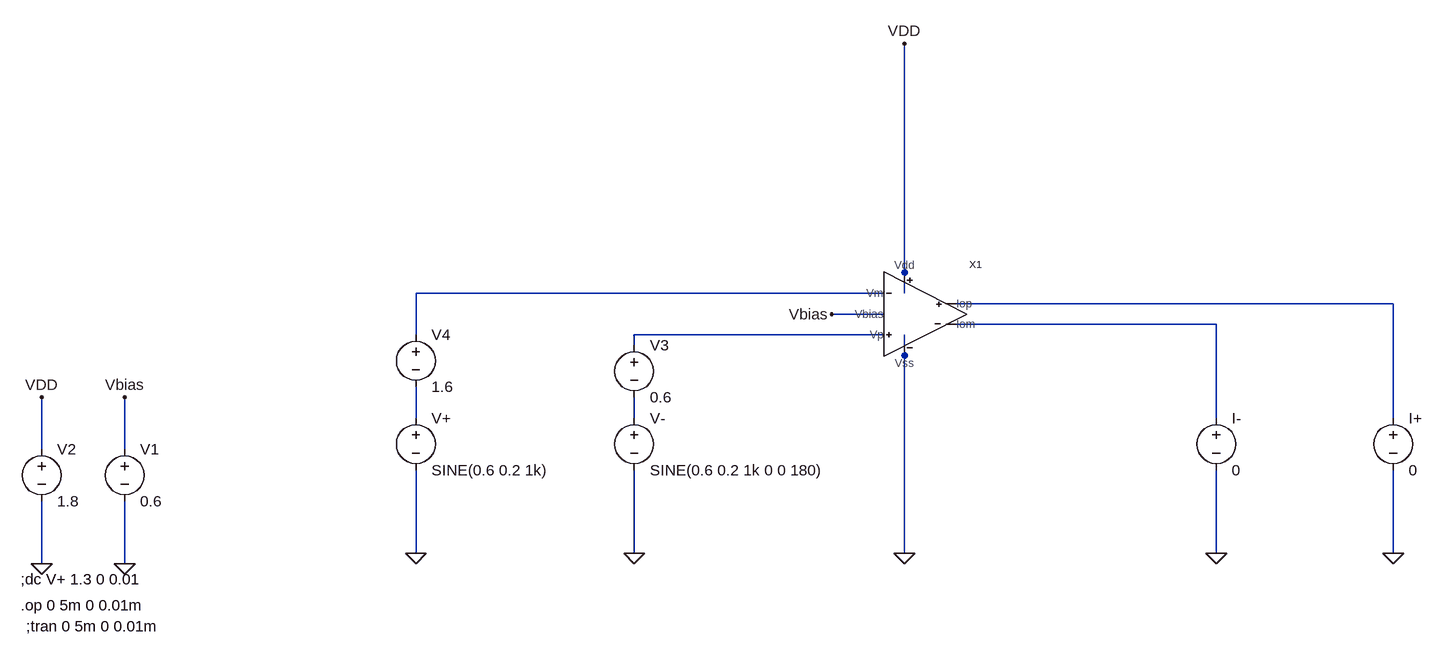
[diagram p0: schematic PREAMP_TB.asc]
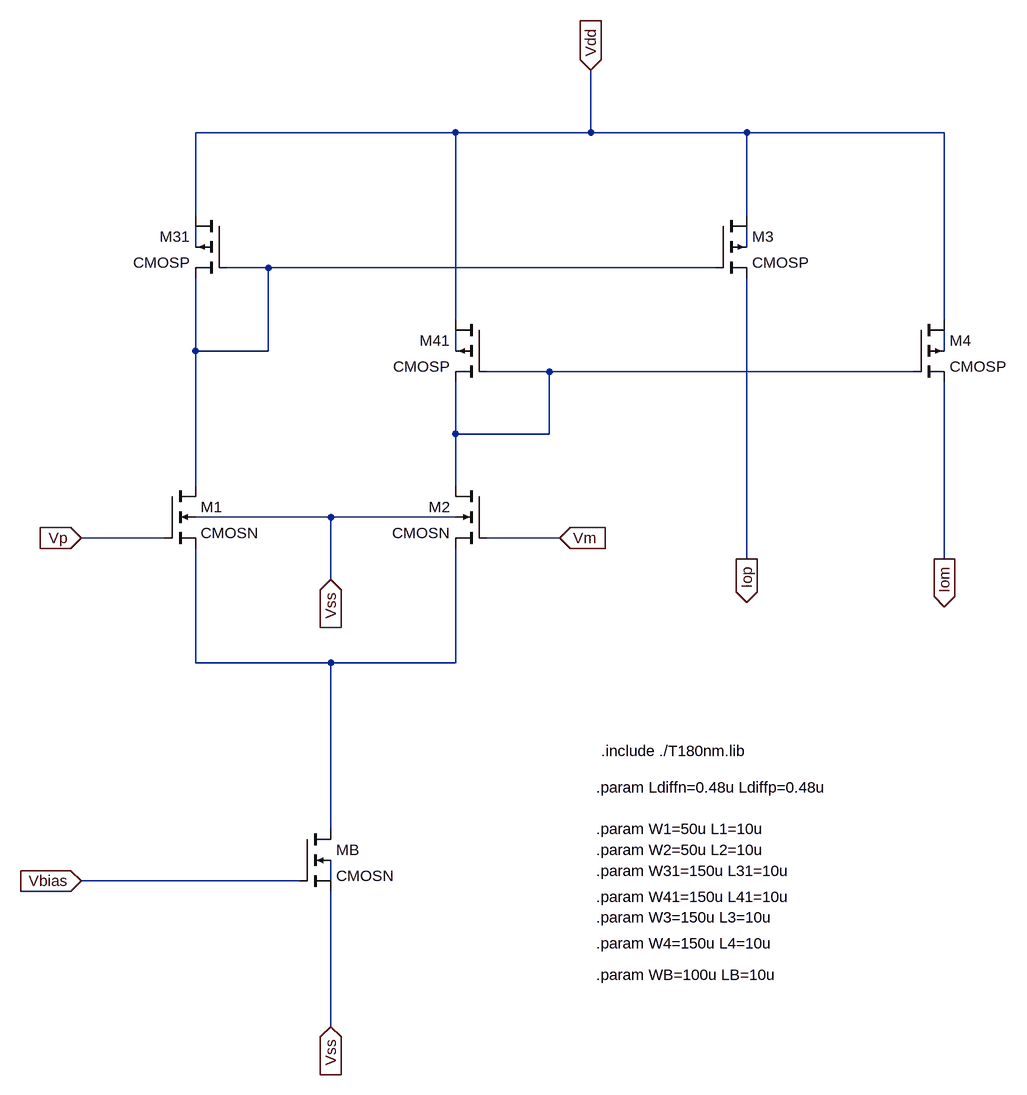
[diagram p1: sub-circuit preamp.asc]
PREAMP_TB.asc, the LTspice schematic file:
Version 4
SHEET 1 1032 1476
WIRE 224 64 224 -288
WIRE 192 96 -528 96
WIRE 224 96 224 64
WIRE 976 112 304 112
WIRE 192 128 112 128
WIRE 704 144 304 144
WIRE -528 160 -528 96
WIRE 192 160 -192 160
WIRE -192 176 -192 160
WIRE 224 192 224 160
WIRE -528 288 -528 240
WIRE -192 288 -192 256
WIRE 704 288 704 144
WIRE 976 288 976 112
WIRE -1104 336 -1104 256
WIRE -976 336 -976 256
WIRE -528 496 -528 368
WIRE -192 496 -192 368
WIRE 224 496 224 192
WIRE 704 496 704 368
WIRE 976 496 976 368
WIRE -1104 512 -1104 416
WIRE -976 512 -976 416
FLAG 224 496 0
FLAG 224 -288 VDD
FLAG -1104 512 0
FLAG -1104 256 VDD
FLAG -976 512 0
FLAG -976 256 Vbias
FLAG 112 128 Vbias
FLAG -192 496 0
FLAG -528 496 0
FLAG 704 496 0
FLAG 976 496 0
SYMBOL voltage -1104 320 R0
WINDOW 123 0 0 Left 2
WINDOW 39 0 0 Left 2
SYMATTR InstName V2
SYMATTR Value 1.8
SYMBOL preamp 224 64 R0
SYMATTR InstName X1
SYMBOL voltage -976 320 R0
WINDOW 123 0 0 Left 2
WINDOW 39 0 0 Left 2
SYMATTR InstName V1
SYMATTR Value 0.6
SYMBOL voltage -192 272 R0
WINDOW 123 0 0 Left 0
WINDOW 39 0 0 Left 0
SYMATTR InstName V-
SYMATTR Value SINE(0.6 0.2 1k 0 0 180)
SYMBOL voltage -528 272 R0
WINDOW 123 0 0 Left 0
WINDOW 39 0 0 Left 0
SYMATTR InstName V+
SYMATTR Value SINE(0.6 0.2 1k)
SYMBOL voltage 704 272 R0
WINDOW 123 0 0 Left 0
WINDOW 39 0 0 Left 0
SYMATTR InstName I-
SYMATTR Value 0
SYMBOL voltage 976 272 R0
WINDOW 123 0 0 Left 0
WINDOW 39 0 0 Left 0
SYMATTR InstName I+
SYMATTR Value 0
SYMBOL voltage -192 160 R0
WINDOW 123 0 0 Left 0
WINDOW 39 0 0 Left 0
SYMATTR InstName V3
SYMATTR Value 0.6
SYMBOL voltage -528 144 R0
WINDOW 123 0 0 Left 0
WINDOW 39 0 0 Left 0
SYMATTR InstName V4
SYMATTR Value 1.6
TEXT -1136 536 Left 2 !;dc V+ 1.3 0 0.01
TEXT -1136 576 Left 2 !.op 0 5m 0 0.01m
TEXT -1128 608 Left 2 !;tran 0 5m 0 0.01m

preamp.asc, the sub-circuit schematic file:
Version 4
SHEET 1 1088 1248
WIRE 240 -224 -160 -224
WIRE 448 -224 448 -320
WIRE 448 -224 240 -224
WIRE 688 -224 448 -224
WIRE 992 -224 688 -224
WIRE -160 -96 -160 -224
WIRE 688 -96 688 -224
WIRE -160 -48 -160 -80
WIRE 688 -48 688 -80
WIRE -48 -16 -112 -16
WIRE 640 -16 -48 -16
WIRE 240 64 240 -224
WIRE 992 64 992 -224
WIRE -160 112 -160 0
WIRE -48 112 -48 -16
WIRE -48 112 -160 112
WIRE 240 112 240 80
WIRE 992 112 992 80
WIRE 384 144 288 144
WIRE 944 144 384 144
WIRE 240 240 240 160
WIRE 384 240 384 144
WIRE 384 240 240 240
WIRE -160 320 -160 112
WIRE 240 320 240 240
WIRE 48 368 -160 368
WIRE 240 368 48 368
WIRE -208 400 -336 400
WIRE 400 400 288 400
WIRE 688 432 688 0
WIRE 992 432 992 160
WIRE 48 464 48 368
WIRE -160 592 -160 416
WIRE 48 592 -160 592
WIRE 240 592 240 416
WIRE 240 592 48 592
WIRE 48 848 48 592
WIRE 0 928 -336 928
WIRE 48 928 48 896
WIRE 48 1152 48 944
FLAG 448 -320 Vdd
IOPIN 448 -320 In
FLAG 48 464 Vss
IOPIN 48 464 In
FLAG -336 400 Vp
IOPIN -336 400 In
FLAG 400 400 Vm
IOPIN 400 400 In
FLAG 48 1152 Vss
IOPIN 48 1152 In
FLAG -336 928 Vbias
IOPIN -336 928 In
FLAG 688 432 Iop
IOPIN 688 432 Out
FLAG 992 432 Iom
IOPIN 992 432 Out
DATAFLAG 48 736 "Id(x2:x1:Mb)"
DATAFLAG -160 256 ""
DATAFLAG 240 272 ""
DATAFLAG 0 592 ""
DATAFLAG 688 320 "Id(x2:x1:M3)"
DATAFLAG 992 320 "Id(x2:x1:M4)"
SYMBOL nmos4 -208 320 R0
SYMATTR InstName M1
SYMATTR Value CMOSN
SYMATTR Value2 l={L1} w={W1} ad={Ldiffn*W1} as={Ldiffn*W1} pd={2*Ldiffn+W1} ps={2*Ldiffn+W1}
SYMBOL pmos4 288 64 M0
SYMATTR InstName M41
SYMATTR Value CMOSP
SYMATTR Value2 l={L41} w={W41} ad={Ldiffp*W41} as={Ldiffp*W41} pd={2*Ldiffp+W41} ps={2*Ldiffp+W41}
SYMBOL nmos4 288 320 M0
SYMATTR InstName M2
SYMATTR Value CMOSN
SYMATTR Value2 l={L2} w={W2} ad={Ldiffn*W2} as={Ldiffn*W2} pd={2*Ldiffn+W2} ps={2*Ldiffn+W2}
SYMBOL pmos4 -112 -96 M0
SYMATTR InstName M31
SYMATTR Value CMOSP
SYMATTR Value2 l={L31} w={W31} ad={Ldiffp*W31} as={Ldiffp*W31} pd={2*Ldiffp+W31} ps={2*Ldiffp+W31}
SYMBOL pmos4 640 -96 R0
SYMATTR InstName M3
SYMATTR Value CMOSP
SYMATTR Value2 l={L3} w={W3} ad={Ldiffp*W3} as={Ldiffp*W3} pd={2*Ldiffp+W3} ps={2*Ldiffp+W3}
SYMBOL pmos4 944 64 R0
SYMATTR InstName M4
SYMATTR Value CMOSP
SYMATTR Value2 l={L4} w={W4} ad={Ldiffp*W4} as={Ldiffp*W4} pd={2*Ldiffp+W4} ps={2*Ldiffp+W4}
SYMBOL nmos4 0 848 R0
SYMATTR InstName MB
SYMATTR Value CMOSN
SYMATTR Value2 l={LB} w={WB} ad={Ldiffn*WB} as={Ldiffn*WB} pd={2*Ldiffn+WB} ps={2*Ldiffn+WB}
TEXT 464 728 Left 2 !.include ./T180nm.lib
TEXT 456 784 Left 2 !.param Ldiffn=0.48u Ldiffp=0.48u
TEXT 456 848 Left 2 !.param W1=50u L1=10u
TEXT 456 880 Left 2 !.param W2=50u L2=10u
TEXT 456 912 Left 2 !.param W31=150u L31=10u
TEXT 456 952 Left 2 !.param W41=150u L41=10u
TEXT 456 984 Left 2 !.param W3=150u L3=10u
TEXT 456 1024 Left 2 !.param W4=150u L4=10u
TEXT 456 1072 Left 2 !.param WB=100u LB=10u

The netlist it stands for:
* PREAMP_TB.asc
V2 VDD 0 1.8
XX1 N004 N001 VDD 0 N002 N003 Vbias preamp
V1 Vbias 0 0.6
V- N006 0 SINE(0.6 0.2 1k 0 0 180)
V+ N005 0 SINE(0.6 0.2 1k)
V§I- N003 0 0
V§I+ N002 0 0
V3 N004 N006 0.6
V4 N001 N005 1.6

* block symbol definitions
.subckt preamp Vp Vm Vdd Vss Iop Iom Vbias
M1 N003 Vp N007 Vss CMOSN l={L1} w={W1} ad={Ldiffn*W1} as={Ldiffn*W1} pd={2*Ldiffn+W1} ps={2*Ldiffn+W1}
M41 Vdd N006 N006 N004 CMOSP l={L41} w={W41} ad={Ldiffp*W41} as={Ldiffp*W41} pd={2*Ldiffp+W41} ps={2*Ldiffp+W41}
M2 N006 Vm N007 Vss CMOSN l={L2} w={W2} ad={Ldiffn*W2} as={Ldiffn*W2} pd={2*Ldiffn+W2} ps={2*Ldiffn+W2}
M31 Vdd N003 N003 N001 CMOSP l={L31} w={W31} ad={Ldiffp*W31} as={Ldiffp*W31} pd={2*Ldiffp+W31} ps={2*Ldiffp+W31}
M3 Vdd N003 Iop N002 CMOSP l={L3} w={W3} ad={Ldiffp*W3} as={Ldiffp*W3} pd={2*Ldiffp+W3} ps={2*Ldiffp+W3}
M4 Vdd N006 Iom N005 CMOSP l={L4} w={W4} ad={Ldiffp*W4} as={Ldiffp*W4} pd={2*Ldiffp+W4} ps={2*Ldiffp+W4}
MB N007 Vbias Vss N008 CMOSN l={LB} w={WB} ad={Ldiffn*WB} as={Ldiffn*WB} pd={2*Ldiffn+WB} ps={2*Ldiffn+WB}
.include ./T180nm.lib
.param Ldiffn=0.48u Ldiffp=0.48u
.param W1=50u L1=10u
.param W2=50u L2=10u
.param W31=150u L31=10u
.param W41=150u L41=10u
.param W3=150u L3=10u
.param W4=150u L4=10u
.param WB=100u LB=10u
.ends preamp

.model NMOS NMOS
.model PMOS PMOS
.lib standard.mos
;dc V+ 1.3 0 0.01
.op 0 5m 0 0.01m
;tran 0 5m 0 0.01m
.backanno
.end